# Altium schematic sheet SH2 - CAN.SchDoc: CAN Transceivers
size B; CheckedBy: Wolfgang Windholtz; Engineer: Sahil Kale; Revision: 1; SheetNumber: 2; SheetTotal: 6
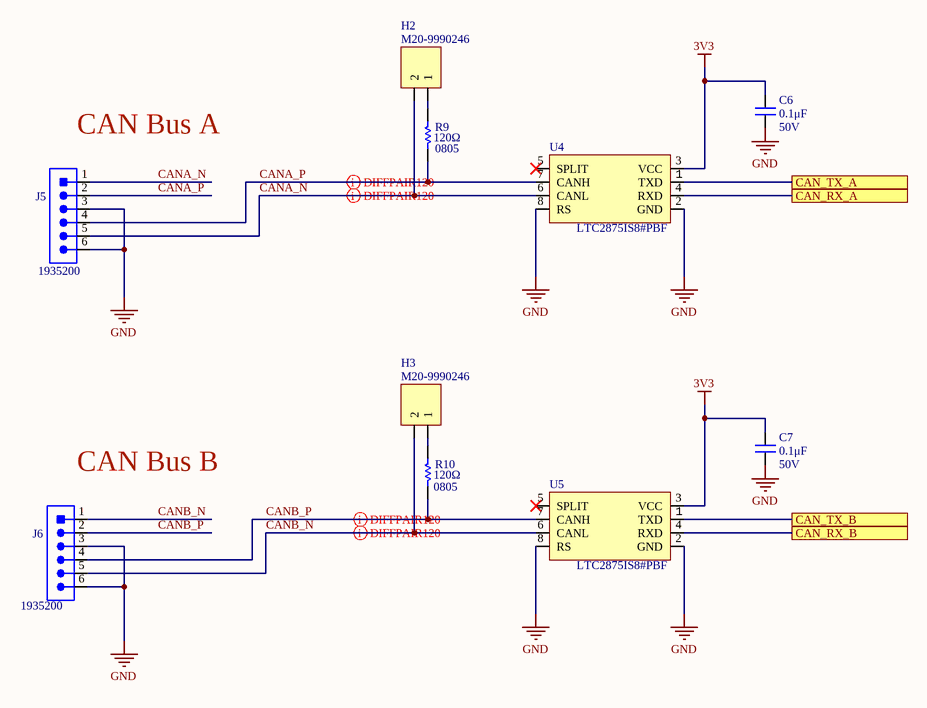
[diagram p0: SH2 - CAN.SchDoc]

## Parts
C6  value 0.1μF  Voltage Rating: 50V  [CAP2012]  (hidden comment: CAP_0.1uF_50V_0805)
C7  value 0.1μF  Voltage Rating: 50V  [CAP2012]  (hidden comment: CAP_0.1uF_50V_0805)
H2  Manufacturer Part Number 1: M20-9990246  [HDR1X2]  (hidden comment: JUMPER)
H3  Manufacturer Part Number 1: M20-9990246  [HDR1X2]  (hidden comment: JUMPER)
J5  CON_6POS_SCREW_TERM  [1935200]  (value not drawn)
J6  CON_6POS_SCREW_TERM  [1935200]  (value not drawn)
R9  value 120Ω  Package/Footprint: 0805  [RESC0805]  (hidden comment: RES_120Ω_0805_1%)
R10  value 120Ω  Package/Footprint: 0805  [RESC0805]  (hidden comment: RES_120Ω_0805_1%)
U4  Manufacturer Part Number 1: LTC2875IS8#PBF  [LT-S8_N]  (hidden comment: IC_CAN_TRANSCEIVER)
U5  Manufacturer Part Number 1: LTC2875IS8#PBF  [LT-S8_N]  (hidden comment: IC_CAN_TRANSCEIVER)

## Ports
CAN_RX_A, CAN_RX_B, CAN_TX_A, CAN_TX_B

## Nets
3V3: C6.1 C7.1 U4.3(VCC) U5.3(VCC)
GND: C6.2 C7.2 J5.3 J5.6 J6.3 J6.6 U4.2(GND) U4.8(RS) U5.2(GND) U5.8(RS)
CAN_RX_A: U4.4(RXD) ; port CAN_RX_A
CAN_RX_B: U5.4(RXD) ; port CAN_RX_B
CAN_TX_A: U4.1(TXD) ; port CAN_TX_A
CAN_TX_B: U5.1(TXD) ; port CAN_TX_B
CANA_N: H2.2 J5.1 J5.5 U4.6(CANL)
CANA_P: J5.2 J5.4 R9.1 U4.7(CANH)
CANB_N: H3.2 J6.1 J6.5 U5.6(CANL)
CANB_P: J6.2 J6.4 R10.1 U5.7(CANH)
NetH2_1: H2.1 R9.2
NetH3_1: H3.1 R10.2

Not connected (* = marked no-connect by the designer): U4 5(SPLIT)*; U5 5(SPLIT)*

## Layout directives
differential pair: CANA_N, CANA_P, CANB_N, CANB_P

## Notes on the sheet
- (near J5) CAN Bus A
- (near J6) CAN Bus B
- Title:
- Project:
- Date:
- Rev:
- Checker:
- Engineer:
- Sheet:
- of

## Library data of the parts
C6 C7 = CAP_0.1uF_50V_0805: CAP CER 0.1UF 50V X7R 0805; Manufacturer Part Number 1: GCM21BR71H104KA37K; Manufacturer 1: Murata Electronics; Package/Footprint: 0805; Supplier Part Number 1: 490-8049-1-ND; Supplier 1: Digi-Key; Dielectric: X7R; Mounting Type: SMD; LCSC Part #: C49678
H2 H3 = JUMPER: HEADER 2X1; Manufacturer 1: Harwin Inc.; Package/Footprint: TH; Supplier 1: Digi-Key; Supplier Part Number 1: 952-2262-ND; Mounting Type: TH
J5 J6 = CON_6POS_SCREW_TERM: TERM BLK 6POS SIDE ENTRY 5MM; Manufacturer 1: Phoenix Contact; Package/Footprint: TH; Wire Gauge: 12-26AWG; Screw Thread: M2.6; Supplier 1: Digi-Key; Supplier Part Number 1: 277-1581-ND; Mounting Type: TH; Pitch: 5mm; Manufacturer Part Number 1: 1935200
R9 R10 = RES_120Ω_0805_1%: RES 120 OHM 1% 1/8W 0805; Manufacturer 1: Vishay; Manufacturer Part Number 1: CRCW0805120RFKEA; Supplier Part Number 1: 541-120CCT-ND; Supplier 1: Digi-Key; Mounting Type: SMD; LCSC Part #: C17437
U4 U5 = IC_CAN_TRANSCEIVER: IC TXRX CAN 4MBPS 8SO; Manufacturer 1: Linear Technologies; Package/Footprint: 8-SOIC; Supplier Part Number 1: LTC2875IS8#PBF-ND; Supplier 1: Digi-Key; Mounting Type: SMD; LCSC Part #: C117076